# EAGLE schematic esp32-watch (EAGLE 9.1.3)
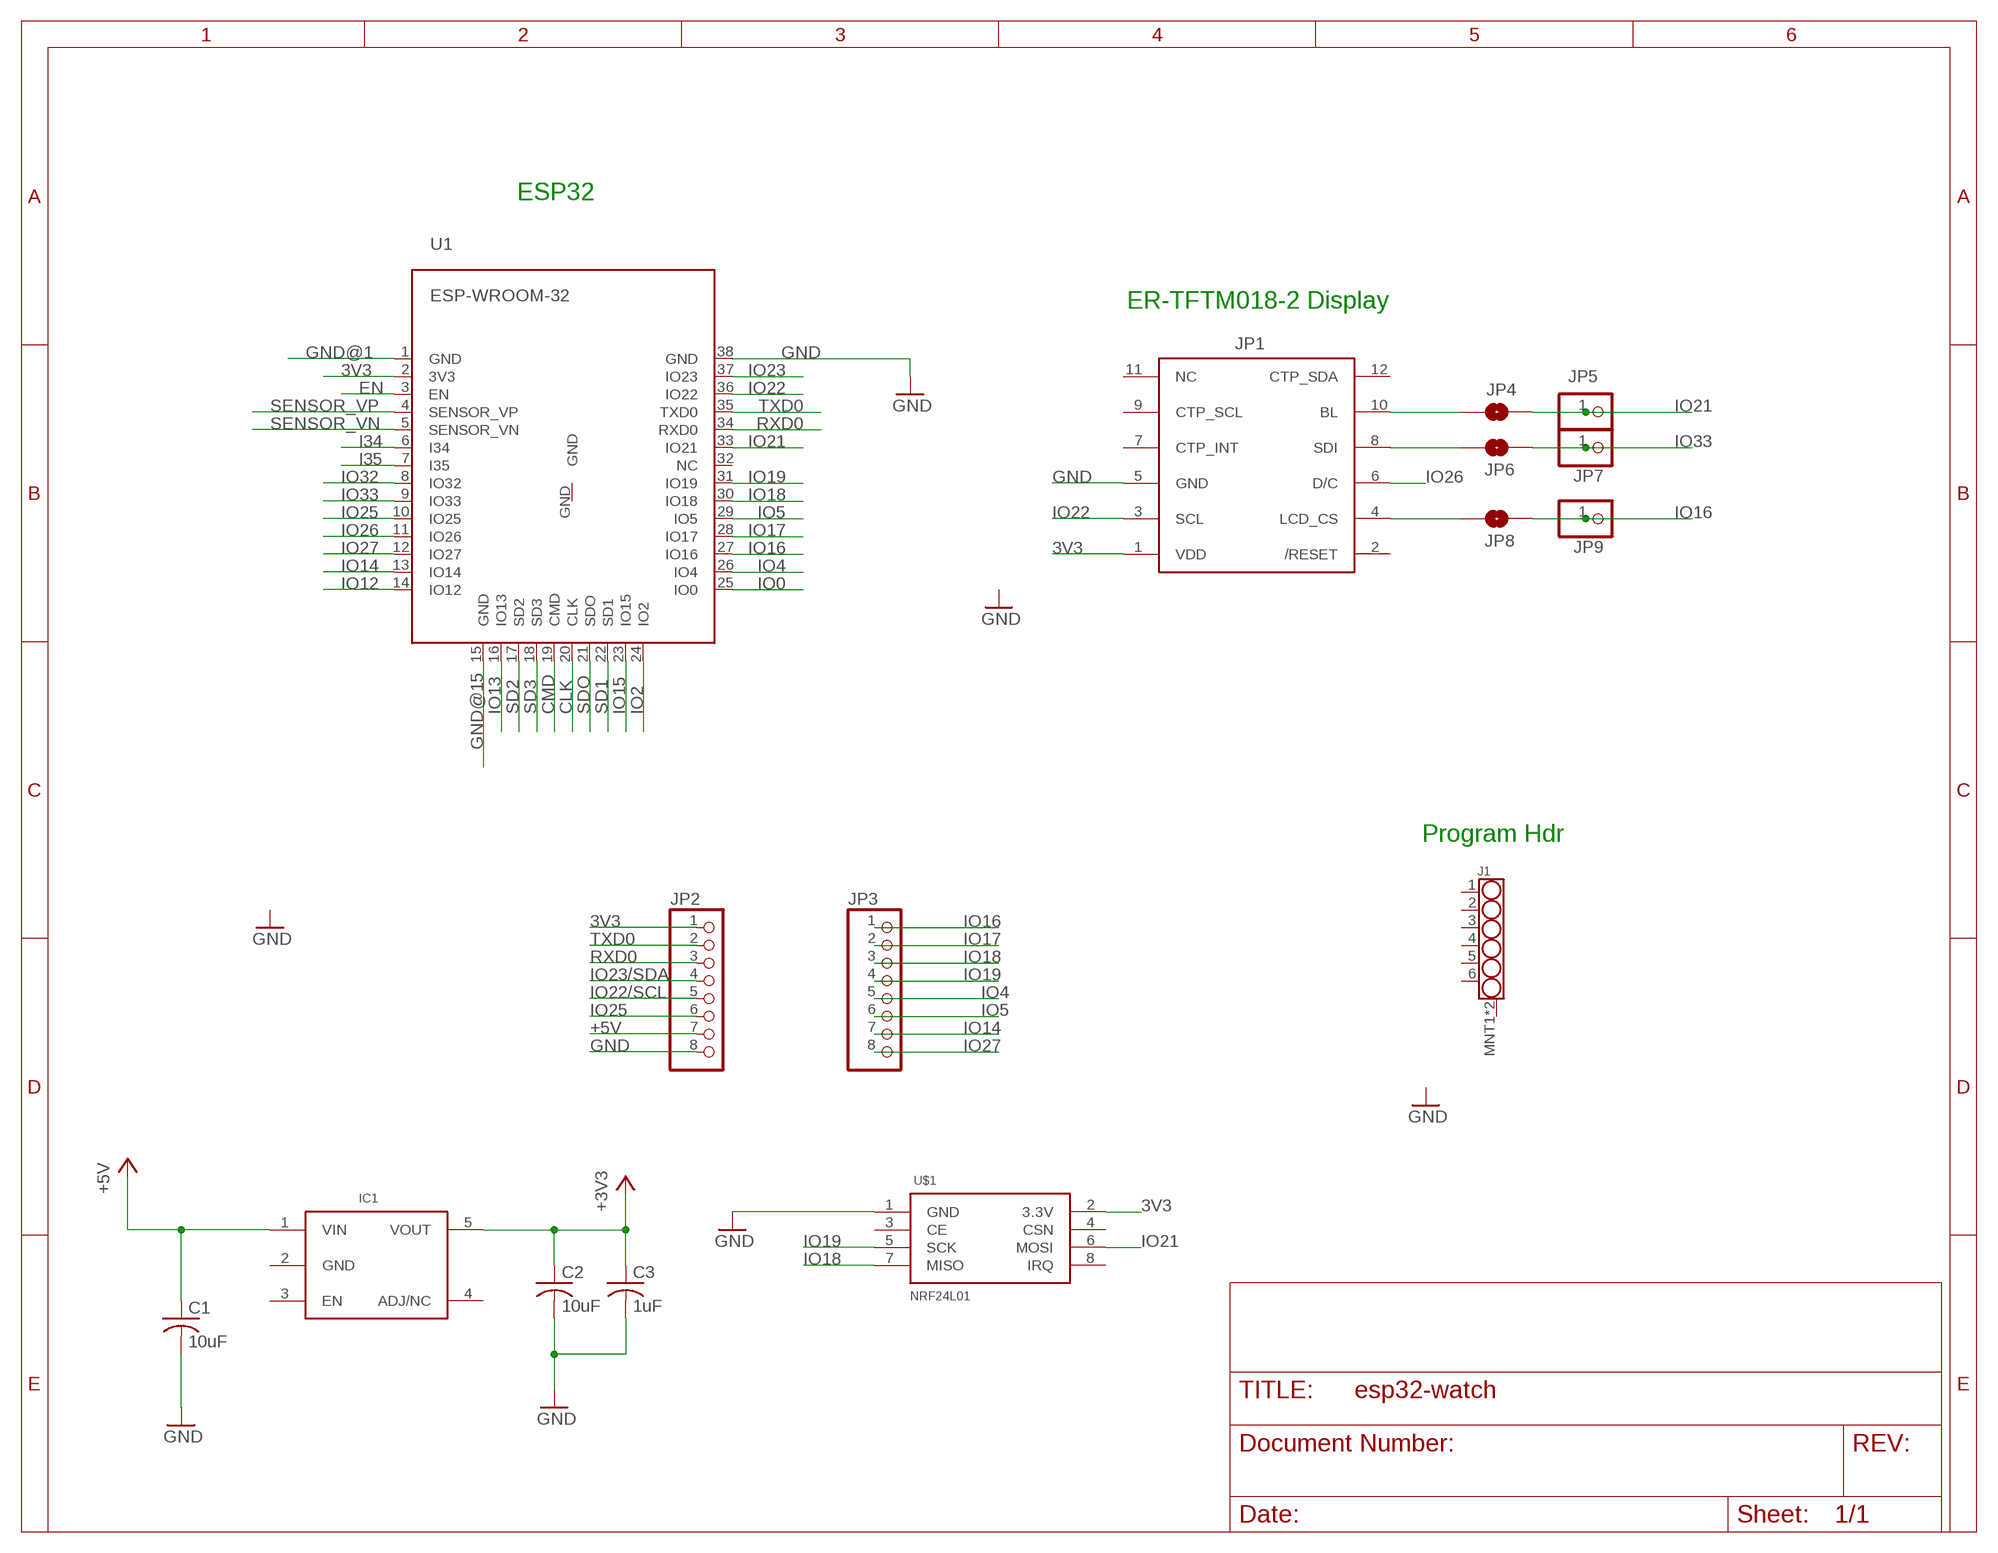
[diagram p0: schematic, sheet 1]

## Parts
C1  10uF  C-USC0805  [C0805]
C2  10uF  C-USC0805  [C0805]
C3  1uF  C-USC0805  [C0805]
IC1  AP2112-3.3  [SOT23-5L]
J1  CON-MOLEX_0532610671  [CON-MOLEX_0532610671]
JP1  ER-TFTM018-2  [ER-TFTM018-2-PTH]
JP2  PINHD-1X8BIG  [1X08-BIG]
JP3  PINHD-1X8BIG  [1X08-BIG]
JP4  JUMPER-SMT_2_NO_NO-SILK  [SMT-JUMPER_2_NO_NO-SILK]
JP5  PINHD-1X1  [1X01]
JP6  JUMPER-SMT_2_NO_NO-SILK  [SMT-JUMPER_2_NO_NO-SILK]
JP7  PINHD-1X1  [1X01]
JP8  JUMPER-SMT_2_NO_NO-SILK  [SMT-JUMPER_2_NO_NO-SILK]
JP9  PINHD-1X1  [1X01]
U1  ESP-WROOM-32  [ESP-WROOM-32]
U$1  NRF24L01  [NRF24L01-MODULE]

## Nets
3V3: JP1.1(VDD) JP2.1 U1.2(3V3) U$1.2(3.3V)
+3V3: C2.1 C3.1 IC1.5(VOUT)
+5V: C1.1 IC1.1(VIN) JP2.7
CLK: U1.20(CLK)
CMD: U1.19(CMD)
EN: U1.3(EN)
GND: C1.2 C2.2 C3.2 JP1.5(GND) JP2.8 U1.38(GND) U$1.1(GND)
GND@1: U1.1(GND)
GND@15: U1.15(GND)
I34: U1.6(I34)
I35: U1.7(I35)
IO0: U1.25(IO0)
IO2: U1.24(IO2)
IO4: JP3.5 U1.26(IO4)
IO5: JP3.6 U1.29(IO5)
IO12: U1.14(IO12)
IO13: U1.16(IO13)
IO14: JP3.7 U1.13(IO14)
IO15: U1.23(IO15)
IO16: JP3.1 JP8.2 JP9.1 U1.27(IO16)
IO17: JP3.2 U1.28(IO17)
IO18: JP3.3 U1.30(IO18) U$1.7(MISO)
IO19: JP3.4 U1.31(IO19) U$1.5(SCK)
IO21: JP4.2 JP5.1 U1.33(IO21) U$1.6(MOSI)
IO22: JP1.3(SCL) U1.36(IO22)
IO22/SCL: JP2.5
IO23: U1.37(IO23)
IO23/SDA: JP2.4
IO25: JP2.6 U1.10(IO25)
IO26: JP1.6(D/C) U1.11(IO26)
IO27: JP3.8 U1.12(IO27)
IO32: U1.8(IO32)
IO33: JP6.2 JP7.1 U1.9(IO33)
N$1: JP1.10(BL) JP4.1
N$2: JP1.8(SDI) JP6.1
N$3: JP1.4(LCD_CS) JP8.1
RXD0: JP2.3 U1.34(RXD0)
SD1: U1.22(SD1)
SD2: U1.17(SD2)
SD3: U1.18(SD3)
SDO: U1.21(SDO)
SENSOR_VN: U1.5(SENSOR_VN)
SENSOR_VP: U1.4(SENSOR_VP)
TXD0: JP2.2 U1.35(TXD0)
Unconnected: IC1.3(EN) IC1.4(ADJ/NC) J1.1 J1.2 J1.3 J1.4 J1.5 J1.6 J1.MNT1(MNT) J1.MNT2(MNT) JP1.2(/RESET) JP1.7(CTP_INT) JP1.9(CTP_SCL) JP1.11(NC) JP1.12(CTP_SDA) U1.32(NC) U1.GND U$1.3(CE) U$1.4(CSN) U$1.8(IRQ)

## Notes on the sheet
- ESP32
- ER-TFTM018-2 Display
- Program Hdr

## Power pins joined to a net without a drawn wire
GND: IC1.2(GND)

## Library data of the parts
C1-C3 = rcl:C-US: CAPACITOR, American symbol
IC1 = VanEagleLib:AP2112-3.3
J1 = VanEagleLib:CON-MOLEX_0532610671: Molex: 6 pin 1.25mm Right Angle SMD connector; DIGIKEY: WM7624CT-ND; MFR: Molex; MPN: 0532610671
JP1 = VanEagleLib:ER-TFTM018-2: 1.8" SPI 128x160 TFT Touch Screen LCD Module from BuyDisplay
JP2 JP3 = adafruit:PINHD-1X8: PIN HEADER
JP4 JP6 JP8 = VanEagleLib:JUMPER-SMT_2_NO: Normally open jumper This jumper has two pads in close proximity to each other. Apply solder to close the connection. Round pads are easier to solder for beginners, but are a lot larger. SparkFun Product that uses the round pads: SparkFun EL Sequencer <https://www.sparkfun.com/products/12781>
JP5 JP7 JP9 = adafruit:PINHD-1X1: Pin header 1x1 for 0.1" spacing With round pins
U1 = VanEagleLib:ESP-WROOM-32
U$1 = VanEagleLib:NRF24L01